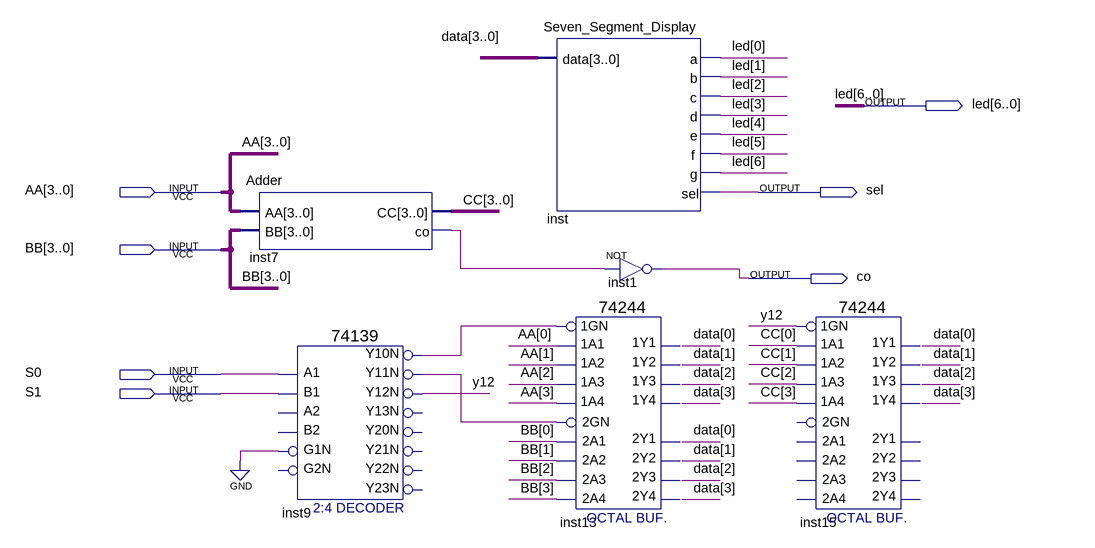
[diagram p0: schematic sheet]
// Quartus schematic Block.bdf as structural Verilog: 6 symbols, 7 pins
module Block (
  input  [3:0] AA,
  input  [3:0] BB,
  input  S0,
  input  S1,
  output [6:0] led,
  output sel,
  output co
);

  wire inst7_co, inst9_y10n, inst9_y11n, y12;
  wire [3:0] CC, data;

  Adder inst7 (.AA(AA), .BB(BB), .CC(CC), .co(inst7_co));
  \74139  inst9 (
    .A1(S0), .B1(S1), .G1N(1'b0), .Y10N(inst9_y10n), .Y12N(y12), .Y11N(inst9_y11n));  // open: A2, B2, G2N, Y20N, Y13N, Y21N, Y22N, Y23N
  Seven_Segment_Display inst (
    .data(data), .a(led[0]), .b(led[1]), .c(led[2]), .d(led[3]), .e(led[4]), .f(led[5]), .g(led[6]), .sel(sel));
  \74244  inst13 (
    .\1A2 (AA[1]), .\1A4 (AA[3]), .\1A1 (AA[0]), .\1A3 (AA[2]), .\1GN (inst9_y10n), .\2A3 (BB[2]),
    .\2GN (inst9_y11n), .\2A1 (BB[0]), .\2A4 (BB[3]), .\2A2 (BB[1]), .\1Y2 (data[1]), .\1Y4 (data[3]),
    .\2Y1 (data[0]), .\1Y1 (data[0]), .\2Y3 (data[2]), .\2Y4 (data[3]), .\1Y3 (data[2]), .\2Y2 (data[1]));
  not inst1 (co, inst7_co);
  \74244  inst15 (
    .\1A2 (CC[1]), .\1A4 (CC[3]), .\1A1 (CC[0]), .\1A3 (CC[2]), .\1GN (y12), .\1Y2 (data[1]),
    .\1Y4 (data[3]), .\1Y1 (data[0]), .\1Y3 (data[2]));  // open: 2A3, 2GN, 2A1, 2A4, 2A2, 2Y1, 2Y3, 2Y4, 2Y2
endmodule
